# Altium schematic sheet LoRa.SchDoc: Наименование
size 209 x 297 mm; ApprovedBy: Утвердил; CheckedBy: Проверил; Author: Разработал; CompanyName: Организация; DrawnBy: Н.Контр; Engineer: Т.Контр; SheetNumber: 4; SheetTotal: 6; PageSetup: Record=PageOptions|CenterHorizontal=True|CenterVertical=True|PrintScale=0.94|XCorrection=1.00|YCorrection=1.00|PrintKind=1|BorderSize=5000000|LeftOffset=0|BottomOffset=0|Orientation=1|PaperLength=1000|PaperWidth=1000|Scale=100|PaperSource=7|PrintQuality=-4|MediaType=1|DitherType=10|PaperKind=A4|PrintScaleMode=1; DecimalNumber: Децимальный номер; HeadOfSector: Нач. сектора; MainDevice: Перв.примен.; Name: Наименование; DocumentName: Sheet1.SCHDOC
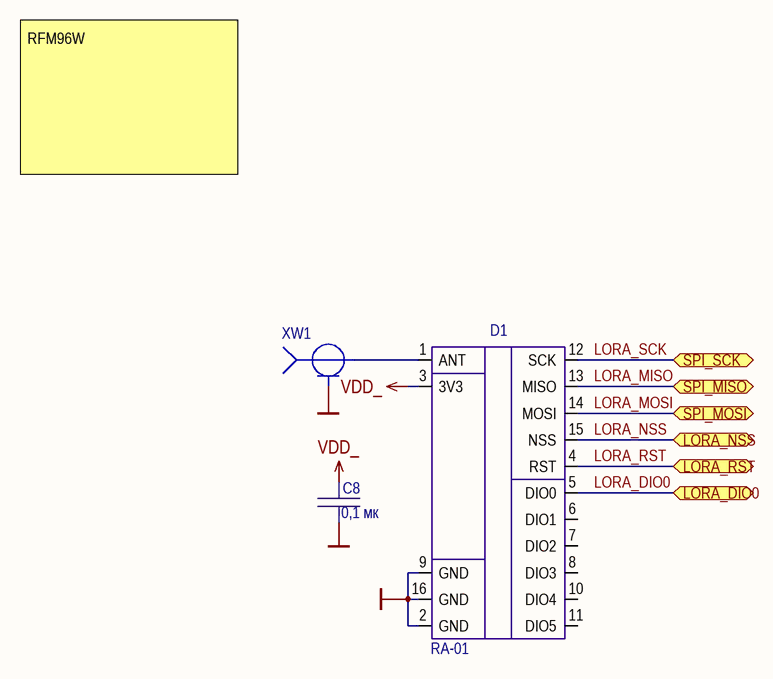
[diagram p0: LoRa.SchDoc]

## Parts
C8  0,1 мк  [C_0603]
D1  RA-01  [RA-02]
XW1  HYR-1139-RP  [SMA (HYR1139)]  (value not drawn)

## Ports
LORA_DIO0 (bidir), LORA_NSS (bidir), LORA_RST (bidir), SPI_MISO (bidir), SPI_MOSI (bidir), SPI_SCK (bidir)

## Nets
GND: D1.2(GND) D1.9(GND) D1.16(GND) XW1.1
VDD_: C8.2 D1.3(3V3)
LORA_DIO0: D1.5(DIO0) ; port LORA_DIO0
LORA_MISO: D1.13(MISO) ; port SPI_MISO
LORA_MOSI: D1.14(MOSI) ; port SPI_MOSI
LORA_NSS: D1.15(NSS) ; port LORA_NSS
LORA_RST: D1.4(RST) ; port LORA_RST
LORA_SCK: D1.12(SCK) ; port SPI_SCK
NetD1_1: D1.1(ANT) XW1.2

Not connected (* = marked no-connect by the designer): C8 1; D1 6(DIO1) 7(DIO2) 8(DIO3) 10(DIO4) 11(DIO5)

## Notes on the sheet
- RFM96W
- Labels drawn without touching a wire or pin: GND
- Подп. и дата
- Инв.№ дубл.
- Взам.инв.№
- Подп.и дата
- Инв.№ подл.
- Изм.
- Лист
- № докум.
- Подп.
- Дата
- Формат  A4

## Library data of the parts
C8 = GRM188R72A104MA35D: CAP CER 0.1UF 100V X7R 0603; Manufacturer: Murata Electronics; Value: 0.1µF; Part Number: GRM188R72A104MA35D; ComponentLink1URL: https://search.murata.co.jp/Ceramy/image/img/A01X/G101/ENG/GRM188R72A104MA35-01.pdf; ComponentLink1Description: Datasheet; Component Type: Capasitor
D1 = RA-01: LoRa modem